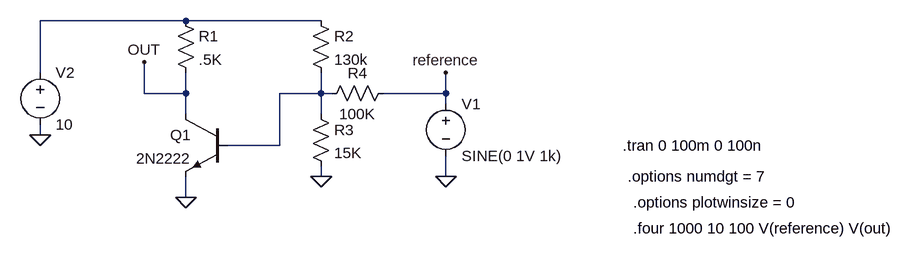
[diagram p0: schematic Draft7.asc]
Draft7.asc, the LTspice schematic file:
Version 4
SHEET 1 880 680
WIRE -384 80 -608 80
WIRE -176 80 -384 80
WIRE -608 160 -608 80
WIRE -448 192 -448 144
WIRE -384 192 -384 160
WIRE -384 192 -448 192
WIRE -176 192 -176 160
WIRE -176 192 -240 192
WIRE -160 192 -176 192
WIRE 16 192 16 160
WIRE 16 192 -80 192
WIRE 16 208 16 192
WIRE -384 224 -384 192
WIRE -176 224 -176 192
WIRE -608 256 -608 240
WIRE -240 272 -240 192
WIRE -240 272 -320 272
WIRE -176 320 -176 304
WIRE 16 320 16 288
WIRE -384 352 -384 320
FLAG 16 160 reference
FLAG 16 320 0
FLAG -608 256 0
FLAG -176 320 0
FLAG -384 352 0
FLAG -448 144 OUT
SYMBOL voltage 16 192 R0
WINDOW 123 0 0 Left 0
WINDOW 39 0 0 Left 0
SYMATTR InstName V1
SYMATTR Value SINE(0 1V 1k)
SYMBOL npn -320 224 M0
SYMATTR InstName Q1
SYMATTR Value 2N2222
SYMBOL res -400 64 R0
SYMATTR InstName R1
SYMATTR Value .5K
SYMBOL res -192 64 R0
SYMATTR InstName R2
SYMATTR Value 130k
SYMBOL res -192 208 R0
SYMATTR InstName R3
SYMATTR Value 15K
SYMBOL res -64 176 R90
WINDOW 0 0 56 VBottom 2
WINDOW 3 32 56 VTop 2
SYMATTR InstName R4
SYMATTR Value 100K
SYMBOL voltage -608 144 R0
WINDOW 123 0 0 Left 0
WINDOW 39 0 0 Left 0
SYMATTR InstName V2
SYMATTR Value 10
TEXT 288 272 Left 2 !.tran 0 100m 0 100n
TEXT 296 320 Left 2 !.options numdgt = 7
TEXT 304 360 Left 2 !.options plotwinsize = 0
TEXT 304 400 Left 2 !.four 1000 10 100 V(reference) V(out)

The netlist it stands for:
* Draft7.asc
V1 reference 0 SINE(0 1V 1k)
Q1 OUT N002 0 0 2N2222
R1 N001 OUT .5K
R2 N001 N002 130k
R3 N002 0 15K
R4 reference N002 100K
V2 N001 0 10
.model NPN NPN
.model PNP PNP
.lib standard.bjt
.tran 0 100m 0 100n
.options numdgt = 7
.options plotwinsize = 0
.four 1000 10 100 V(reference) V(out)
.backanno
.end